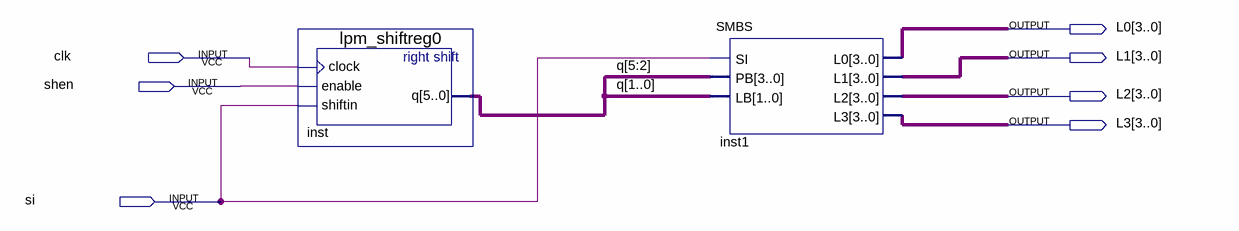
[diagram p0: schematic sheet]
// Quartus schematic datapath.bdf as structural Verilog: 2 symbols, 7 pins
module datapath (
  input  clk,
  input  shen,
  input  si,
  output [3:0] L0,
  output [3:0] L1,
  output [3:0] L2,
  output [3:0] L3
);

  wire [5:0] q;

  lpm_shiftreg0 inst (.clock(clk), .enable(shen), .shiftin(si), .q(q));
  SMBS inst1 (.SI(si), .PB(q[5:2]), .LB(q[1:0]), .L0(L0), .L1(L1), .L2(L2), .L3(L3));
endmodule
